# EAGLE design dremel (EAGLE 6.5.0)
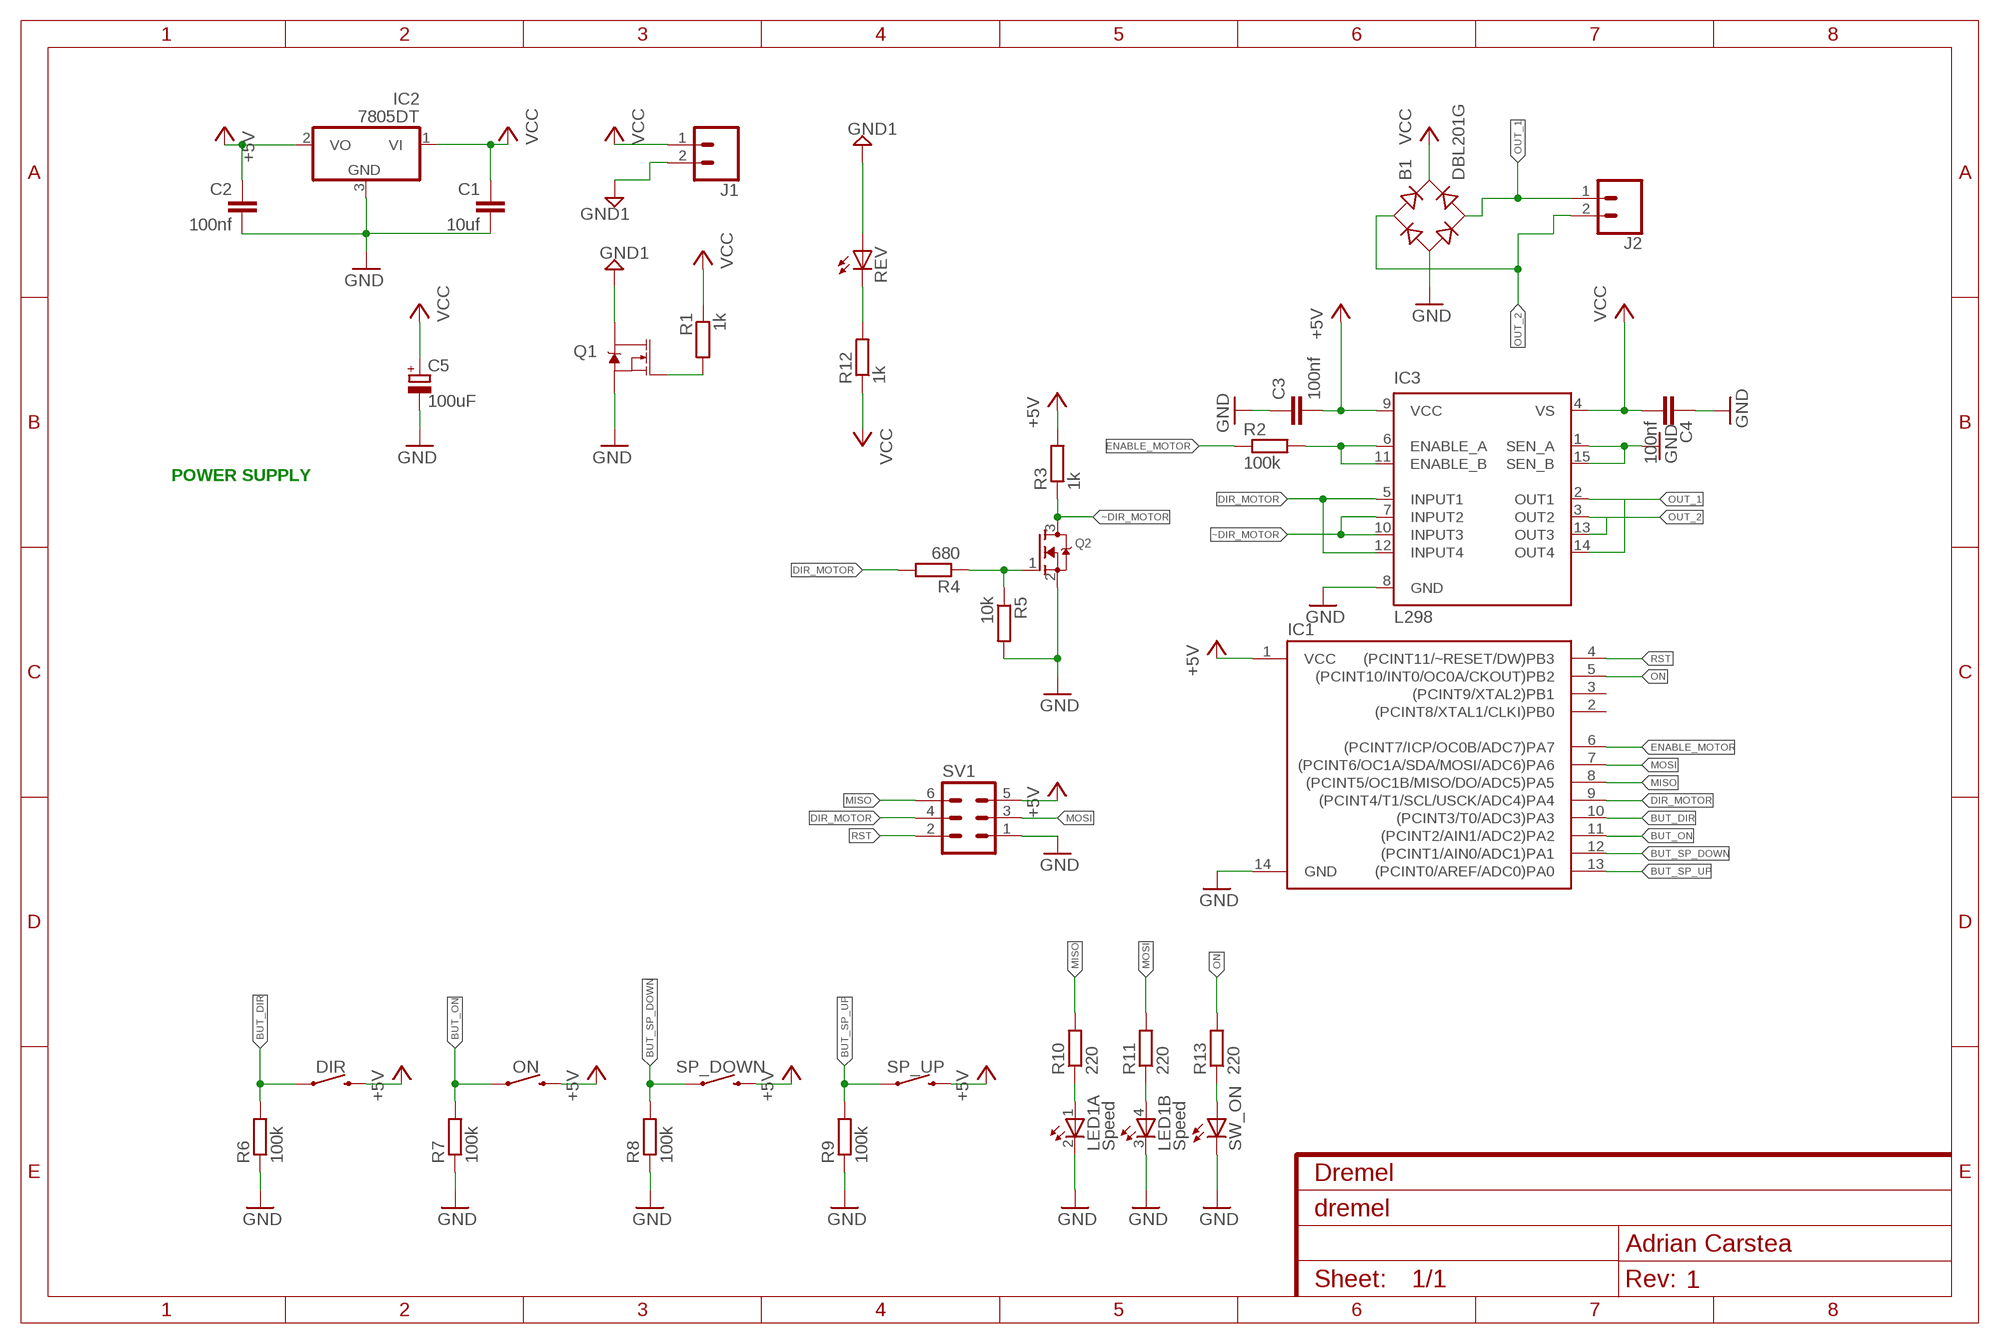
[diagram p0: schematic, sheet 1]
FRAME1 (FRAME-A4L): CNAME: Dremel; CREVISION: 1; DESIGNER: Adrian Carstea

## Parts
B1  DBL201G  [DB]
C1  10uf  C-EUC1206  [C1206]
C2  100nf  C-EUC1206  [C1206]
C3  100nf  C-EUC1206  [C1206]
C4  100nf  C-EUC1206  [C1206]
C5  100uF  CPOL-EUE5-10.5  [E5-10,5]
DIR  MOMENTARY-SWITCH-SPST-SMD-5.2MM  [TACTILE_SWITCH_SMD_5.2MM]
IC1  ATTINY84ATTINY84-20PU  [DIP14]
IC2  7805DT  [TO252]
IC3  L298  [MULTIWATT-15]
J1  CONN_025MM  [SCREWTERMINAL-5MM-2]
J2  CONN_025MM  [SCREWTERMINAL-5MM-2]
LED1  Speed  TOPLED-2-/  [P-LCC-4/2]
ON  MOMENTARY-SWITCH-SPST-SMD-5.2MM  [TACTILE_SWITCH_SMD_5.2MM]
Q1  MOSFET-NCH-FDD8780  [DPAK]
Q2  MOSFET-NREFLOW  [SOT23]
R1  1k  R-EU_R0805  [R0805]
R2  100k  R-EU_M0805  [M0805]
R3  1k  R-EU_M0805  [M0805]
R4  680  R-EU_M0805  [M0805]
R5  10k  R-EU_M0805  [M0805]
R6  100k  R-EU_M0805  [M0805]
R7  100k  R-EU_M0805  [M0805]
R8  100k  R-EU_M0805  [M0805]
R9  100k  R-EU_M0805  [M0805]
R10  220  R-EU_M0805  [M0805]
R11  220  R-EU_M0805  [M0805]
R12  1k  R-EU_M0805  [M0805]
R13  220  R-EU_M0805  [M0805]
REV  LEDSML0805  [SML0805]
SP_DOWN  MOMENTARY-SWITCH-SPST-SMD-5.2MM  [TACTILE_SWITCH_SMD_5.2MM]
SP_UP  MOMENTARY-SWITCH-SPST-SMD-5.2MM  [TACTILE_SWITCH_SMD_5.2MM]
SV1  MA03-2  [MA03-2]
SW_ON  LEDSML0805  [SML0805]

## Nets
+5V: C2.1 C3.2 DIR.3 IC1.1(VCC) IC2.2(VO) IC3.9(VCC) ON.3 R3.2 SP_DOWN.3 SP_UP.3 SV1.5
BUT_DIR: DIR.1 IC1.10((PCINT3/T0/ADC3)PA3) R6.2
BUT_ON: IC1.11((PCINT2/AIN1/ADC2)PA2) ON.1 R7.2
BUT_SP_DOWN: IC1.12((PCINT1/AIN0/ADC1)PA1) R8.2 SP_DOWN.1
BUT_SP_UP: IC1.13((PCINT0/AREF/ADC0)PA0) R9.2 SP_UP.1
DIR_MOTOR: IC1.9((PCINT4/T1/SCL/USCK/ADC4)PA4) IC3.5(INPUT1) IC3.12(INPUT4) R4.2 SV1.4
ENABLE_MOTOR: IC1.6((PCINT7/ICP/OC0B/ADC7)PA7) R2.1
GND: B1.- C1.2 C2.2 C3.1 C4.1 C5.- IC1.14(GND) IC2.3(GND) IC3.1(SEN_A) IC3.8(GND) IC3.15(SEN_B) LED1.2(A:C) LED1.3(B:C) Q1.3(S) Q2.2(S) R5.2 R6.1 R7.1 R8.1 R9.1 SV1.1 SW_ON.C
GND1: J1.2 Q1.4(D) REV.A
MISO: IC1.8((PCINT5/OC1B/MISO/DO/ADC5)PA5) R10.2 SV1.6
MOSI: IC1.7((PCINT6/OC1A/SDA/MOSI/ADC6)PA6) R11.2 SV1.3
N$1: Q1.1(G) R1.2
N$2: IC3.6(ENABLE_A) IC3.11(ENABLE_B) R2.2
N$3: Q2.1(G) R4.1 R5.1
N$5: LED1.1(A:A) R10.1
N$6: LED1.4(B:A) R11.1
N$7: R12.2 REV.C
N$9: R13.1 SW_ON.A
ON: IC1.5((PCINT10/INT0/OC0A/CKOUT)PB2) R13.2
OUT_1: B1.AC2 IC3.2(OUT1) IC3.14(OUT4) J2.1
OUT_2: B1.AC1 IC3.3(OUT2) IC3.13(OUT3) J2.2
RST: IC1.4((PCINT11/~RESET/DW)PB3) SV1.2
VCC: B1.+ C1.1 C4.2 C5.+ IC2.1(VI) IC3.4(VS) J1.1 R1.1 R12.1
~DIR_MOTOR: IC3.7(INPUT2) IC3.10(INPUT3) Q2.3(D) R3.1
Unconnected: IC1.2((PCINT8/XTAL1/CLKI)PB0) IC1.3((PCINT9/XTAL2)PB1)

## Notes on the sheet
- POWER SUPPLY

## Library data of the parts
B1 = rectifier:DB?*G: Single Phase 1.0 AMP Glass Passivated Bridge Rectifier Taiwan Semiconductor Co.,Ltd. - TSC Source: http://www.taiwansemi.com/TSCbig5/ezcatfiles/cust/img/img/db101g.pdf http://www.ts.com.tw/db/pictures/modules/PDT/PDT060207001/DBLS201G.pdf
C1-C4 = rcl:C-EU: CAPACITOR, European symbol
C5 = rcl:CPOL-EU: POLARIZED CAPACITOR, European symbol
DIR ON SP_DOWN SP_UP = SparkFun-Switches:MOMENTARY-SWITCH-SPST: Momentary Switch (Pushbutton) - SPST Normally-open (NO) SPST momentary switches (buttons, pushbuttons). Variants PTH-12MM - 12mm square, through-hole Momentary Pushbutton Switch - 12mm Square <https://www.sparkfun.com/products/9190> (COM-09190) PTH-6.0MM, PTH-6.0MM-KIT - 6.0mm square, through-hole Mini Pushbutton Switch <https://www.sparkfun.com/products/97> (COM-00097) KIT package intended for soldering kit's - only one side of pads' copper is exposed. PTH-RIGHT-ANGLE-KIT - Right-angle, through-hole Right Angle Tactile Button <https://www.sparkfun.com/products/10791> - Used on SparkFun BigTime Watch Kit <https://www.sparkfun.com/products/11734> SMD-12MM - 12mm square, surface-mount Tactile Button - SMD (12mm) <https://www.sparkfun.com/products/12993> (COM-12993) Used on SparkFun PicoBoard <https://www.sparkfun.com/products/11888> SMD-4.5MM - 4.5mm Square Trackball Switch Used on SparkFun Blackberry Trackballer Breakout <https://www.sparkfun.com/products/13169> SMD-4.6MMX2.8MM - 4.60mm x 2.80mm, surface mount Used on SparkFun SAMD21 Mini Breakout <https://www.sparkfun.com/products/13664> SMD-5.2MM, SMD-5.2-REDUNDANT - 5.2mm square, surface-mount Mini Pushbutton Switch - SMD <https://www.sparkfun.com/products/8720> (COM-08720) Used on Arduino Pro Mini <https://www.sparkfun.com/products/11114> REDUNDANT package connects both switch circuits together SMD-6.0X3.5MM - 6.0 x 3.5mm, surface mount Momentary Reset Switch SMD <https://www.sparkfun.com/products/8229> (COM-08229) SMD-6.2MM-TALL - 6.2mm square, surface mount Tactile Button - SMD (6mm) <https://www.sparkfun.com/products/12992> Used on SparkFun Digital Sandbox <https://www.sparkfun.com/products/12651> SMD-RIGHT-ANGLE - Right-angle, surface mount Used on SparkFun Block for Intel® Edison - Arduino <https://www.sparkfun.com/products/13036>; PROD_ID: SWCH-08247; SF_SKU: COM-08720
IC1 = SparkFun-IC-Microcontroller:ATTINY84: Atmel 14-pin 2/4/8kB flash uC Datasheet <https://cdn.sparkfun.com/datasheets/Widgets/doc8006.pdf> SparkFun Products Tiny AVR Programmer <https://www.sparkfun.com/products/11801> (PGM-11801) SparkFun Servo Trigger - Continuous Rotation <https://www.sparkfun.com/products/13872> (WIG-13872) SparkFun Servo Trigger <https://www.sparkfun.com/products/13118> (WIG-13118)
IC2 = adafruit:78*: Positive VOLTAGE REGULATOR Added bigger pads to the TO-92 package
IC3 = st-microelectronics:L298: DUAL FULL-BRIDGE DRIVER; MPN: L298N; OC_FARNELL: 1589425; OC_NEWARK: 32M1527
J1 J2 = SparkFun-Connectors:CONN_02: Multi connection point. Often used as Generic Header-pin footprint for 0.1 inch spaced/style header connections On any of the 0.1 inch spaced packages, you can populate with these: Break Away Headers - Straight <https://www.sparkfun.com/products/116> (PRT-00116) Break Away Male Headers - Right Angle <https://www.sparkfun.com/products/553> (PRT-00553) Female Headers <https://www.sparkfun.com/products/115> (PRT-00115) Break Away Headers - Machine Pin <https://www.sparkfun.com/products/117> (PRT-00117) Break Away Female Headers - Swiss Machine Pin <https://www.sparkfun.com/products/743> (PRT-00743) For SCREWTERMINALS and SPRING TERMINALS visit here: Screw Terimnals on SparkFun.com <https://www.sparkfun.com/search/results?term=Screw+Terminals> (5mm/3.5mm/2.54mm spacing) This device is also useful as a general connection point to wire up your design to another part of your project. Our various solder wires solder well into these plated through hole pads. Hook-Up Wire - Assortment (Stranded, 22 AWG) <https://www.sparkfun.com/products/11375> (PRT-11375) Hook-Up Wire - Assortment (Solid Core, 22 AWG) <https://www.sparkfun.com/products/11367> (PRT-11367) View the entire wire category on our website here <https://www.sparkfun.com/categories/141> Special notes: Molex polarized connector foot print use with: PRT-08233 with associated crimp pins and housings. 2.54_SCREWTERM for use with PRT-10571. 3.5mm Screw Terminal footprints for PRT-08084 5mm Screw Terminal footprints for use with PRT-08432; SF_SKU: PRT-08432
LED1 = led:TOPLED-2-: Multi TOPLED® (two color) LG T672, LP T672 LSY T67B LSW T67C LSY T675 LSY T676 LSG T677 LSG T770 Source: http://www.osram.convergy.de/
Q1 = SparkFun-DiscreteSemi:MOSFET-NCH: N-channel MOSFETs Voltage controlled devices that allow control of high current outputs. SparkFun Products: SparkFun OpenScale <https://www.sparkfun.com/products/13261> SparkFun Digital Sandbox <https://www.sparkfun.com/products/12651> SparkFun Monster Moto Shield <https://www.sparkfun.com/products/10182> SparkFun MOSFET Power Controller <https://www.sparkfun.com/products/11214>; PROD_ID: TRANS-09984; VALUE: 35A/25V/8.5mΩ
Q2 = adafruit:MOSFET-N: N-Channel Mosfet 2N7002E - 60V 260mA SOT23 [Digikey: 2N7002ET1GOSTR-ND] - REEL BSH103 - 30V 850mA SOT23 [Digikey: 568-5013-1-ND]
R1-R13 = rcl:R-EU_: RESISTOR, European symbol
REV SW_ON = led:LED: LED OSRAM: - CHIPLED LG R971, LG N971, LY N971, LG Q971, LY Q971, LO R971, LY R971 LH N974, LH R974 LS Q976, LO Q976, LY Q976 LO Q996 - Hyper CHIPLED LW Q18S LB Q993, LB Q99A, LB R99A - SideLED LS A670, LO A670, LY A670, LG A670, LP A670 LB A673, LV A673, LT A673, LW A673 LH A674 LY A675 LS A676, LA A676, LO A676, LY A676, LW A676 LS A679, LY A679, LG A679 - Hyper Micro SIDELED® LS Y876, LA Y876, LO Y876, LY Y876 LT Y87S - SmartLED LW L88C, LW L88S LB L89C, LB L89S, LG L890 LS L89K, LO L89K, LY L89K LS L896, LA L896, LO L896, LY L896 - TOPLED LS T670, LO T670, LY T670, LG T670, LP T670 LSG T670, LSP T670, LSY T670, LOP T670, LYG T670 LG T671, LOG T671, LSG T671 LB T673, LV T673, LT T673, LW T673 LH T674 LS T676, LA T676, LO T676, LY T676, LB T676, LH T676, LSB T676, LW T676 LB T67C, LV T67C, LT T67C, LS T67K, LO T67K, LY T67K, LW E67C LS E67B, LA E67B, LO E67B, LY E67B, LB E67C, LV E67C, LT E67C LW T67C LS T679, LY T679, LG T679 LS T770, LO T770, LY T770, LG T770, LP T770 LB T773, LV T773, LT T773, LW T773 LH T774 LS E675, LA E675, LY E675, LS T675 LS T776, LA T776, LO T776, LY T776, LB T776 LHGB T686 LT T68C, LB T68C - Hyper Mini TOPLED® LB M676 - Mini TOPLED Santana® LG M470 LS M47K, LO M47K, LY M47K Source: http://www.osram.convergy.de LUXEON: - LUMILED® LXK2-PW12-R00, LXK2-PW12-S00, LXK2-PW14-U00, LXK2-PW14-V00 LXK2-PM12-R00, LXK2-PM12-S00, LXK2-PM14-U00 LXK2-PE12-Q00, LXK2-PE12-R00, LXK2-PE12-S00, LXK2-PE14-T00, LXK2-PE14-U00 LXK2-PB12-K00, LXK2-PB12-L00, LXK2-PB12-M00, LXK2-PB14-N00, LXK2-PB14-P00, LXK2-PB14-Q00 LXK2-PR12-L00, LXK2-PR12-M00, LXK2-PR14-Q00, LXK2-PR14-R00 LXK2-PD12-Q00, LXK2-PD12-R00, LXK2-PD12-S00 LXK2-PH12-R00, LXK2-PH12-S00 LXK2-PL12-P00, LXK2-PL12-Q00, LXK2-PL12-R00 Source: www.luxeon.com KINGBRIGHT: KA-3528ASYC Source: www.kingbright.com
SV1 = con-lstb:MA03-2: PIN HEADER; OC_FARNELL: unknown; OC_NEWARK: unknown

## Board
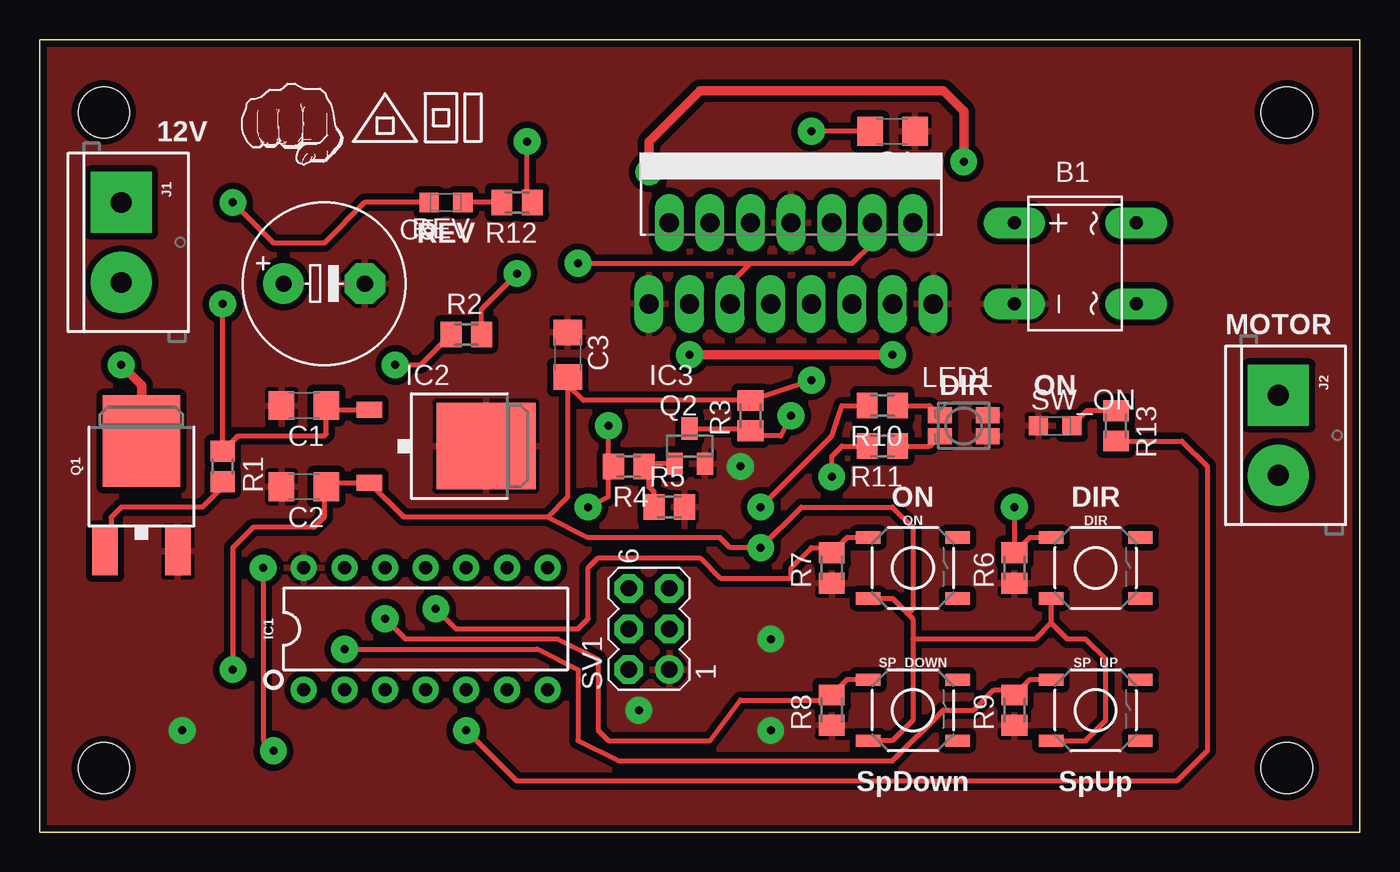
[diagram p1: board, top side]
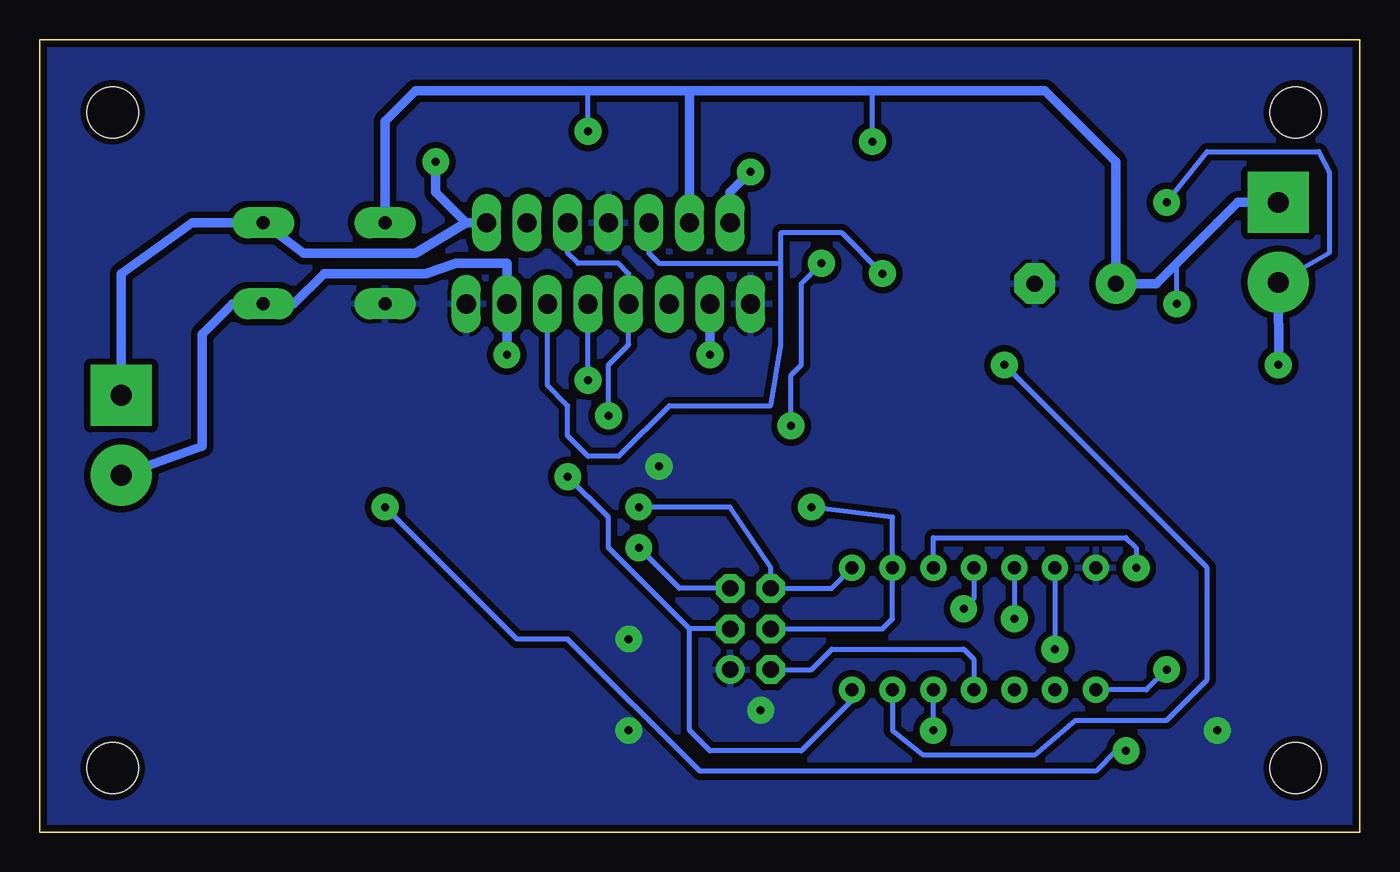
[diagram p2: board, bottom side, seen from below]

Size 82.55 x 49.53 mm. Coordinates in mm from the lower left corner, seen from the top.
Outline: 0,0 82.55,0 82.55,49.53 0,49.53 0,0
Copper layers (1*16): Top 0.0356mm / dielectric 1.5011mm / Bottom 0.0356mm
Design rules "oshpark-2layer *": minimum track width 6mil, minimum drill 13mil, track to track 6mil, track to pad 6mil, pad to pad 6mil, via to via 6mil, smd to smd 6mil, copper to edge 15mil, drill to drill 6mil, minimum pad ring 7mil, minimum via ring 7mil, stop-mask expansion 2.5mil, vias tented up to drill 20mil, thermal gap 10mil
Holes 3.2 mm at 4,4 4,45 78,45 78,4

### Footprints (pad centres in the part's own frame; a part is rotated, then mirrored left to right if it is on the bottom)
DB = drill 0.813 pad 1.93 long: + -2.54,-3.81; - 2.54,-3.81; AC1 2.54,3.81; AC2 -2.54,3.81
C1206 = smd 1.6 x 1.8: 1 -1.4,0; 2 1.4,0
E5-10,5 = drill 1.016 pad 2.54: + -2.54,0 | drill 1.016 pad 2.54 octagon: - 2.54,0
TACTILE_SWITCH_SMD_5.2MM = smd 1.524 x 0.762: 1 -2.794,1.905; 2 2.794,1.905; 3 -2.794,-1.905; 4 2.794,-1.905
DIP14 = drill 0.813 pad 1.626: 1 -7.62,-3.81; 2 -5.08,-3.81; 3 -2.54,-3.81; 4 0,-3.81; 5 2.54,-3.81; 6 5.08,-3.81; 7 7.62,-3.81; 8 7.62,3.81; 9 5.08,3.81; 10 2.54,3.81; 11 0,3.81; 12 -2.54,3.81; 13 -5.08,3.81; 14 -7.62,3.81
TO252 = smd 1 x 1.6: 1 -2.28,-4.8; 2 2.28,-4.8 | smd 5.4 x 6.2: 3 0,2.5
MULTIWATT-15 = drill 1.2 long: 1 -8.89,-7.62; 2 -7.62,-2.54; 3 -6.35,-7.62; 4 -5.08,-2.54; 5 -3.81,-7.62; 6 -2.54,-2.54; 7 -1.27,-7.62; 8 0,-2.54; 9 1.27,-7.62; 10 2.54,-2.54; 11 3.81,-7.62; 12 5.08,-2.54; 13 6.35,-7.62; 14 7.62,-2.54; 15 8.89,-7.62
SCREWTERMINAL-5MM-2 = drill 1.3 pad 3.81 square: 1 0,0 | drill 1.3 pad 3.81: 2 5,0
P-LCC-4/2 = smd 1 x 1.5: 1 -0.65,-1.5; 2 -0.65,1.5; 3 0.65,1.5; 4 0.65,-1.5
DPAK = smd 1.6 x 3: 1 -2.28,-5.31; 3 2.28,-5.31 | smd 4.826 x 5.715: 4 0,1.588
SOT23 = smd 1 x 1.4: 1 -0.95,-1.1; 2 0.95,-1.1; 3 0,1.1
R0805 = smd 1.3 x 1.5: 1 -0.95,0; 2 0.95,0
M0805 = smd 1.3 x 1.6: 1 -0.95,0; 2 0.95,0
SML0805 = smd 1.2 x 1.2: A 1.05,0; C -1.05,0
MA03-2 = drill 1.016 pad 1.778: 1 -2.54,-1.27 | drill 1.016 pad 1.778 octagon: 2 -2.54,1.27; 3 0,-1.27; 4 0,1.27; 5 2.54,-1.27; 6 2.54,1.27

### Placement (x,y rotation side)
B1  64.77,35.56 270 top
C1  16.51,26.67 180 top
C2  16.51,21.59 180 top
C3  33.02,29.84 270 top
C4  53.34,43.81 180 top
C5  17.78,34.29 0 top
DIR  66.04,16.51 0 top
IC1  24.13,12.7 0 top
IC2  25.4,24.13 270 top
IC3  46.99,40.64 0 top
J1  5.08,39.37 270 top
J2  77.47,27.3 270 top
LED1  57.78,25.4 270 top
ON  54.61,16.51 0 top
Q1  6.35,22.86 0 top
Q2  40.64,24.13 0 top
R1  11.43,22.86 270 top
R2  26.67,31.11 0 top
R3  44.45,26.04 90 top
R4  36.83,22.86 180 top
R5  39.37,20.32 0 top
R6  60.96,16.51 90 top
R7  49.53,16.51 90 top
R8  49.53,7.62 90 top
R9  60.96,7.62 90 top
R10  52.7,26.67 180 top
R11  52.7,24.13 180 top
R12  29.84,39.37 180 top
R13  67.31,25.4 270 top
REV  25.4,39.37 180 top
SP_DOWN  54.61,7.62 0 top
SP_UP  66.04,7.62 0 top
SV1  38.1,12.7 90 top
SW_ON  63.5,25.4 0 top
U$1  [ADILOGO]  20.32,43.18 0 top

### Tracks (layer width: path | path; a pad name or v marks a point on that pad's centre or on a via)
+5V  (via drill 0.5 pad 1.68)
  Top 0.305: v12.06,10.16 12.06,17.78 13.34,19.05 17.14,19.05 17.78,19.68 17.78,21.46 C2.1 18.17,21.85 IC2.2 22.77,19.68 31.75,19.68 | 31.75,19.68 33.02,20.95 33.02,27.94 | 31.75,19.68 34.29,18.41 42.55,18.41 43.18,17.78 v45.09,17.78 47.62,20.32 53.34,20.32 54.61,19.05 54.61,13.97 54.29,13.65 | ON.3 53.34,14.61 54.29,13.65 | 54.29,13.65 54.61,13.34 54.61,12.06 | 54.61,12.06 54.61,6.99 53.34,5.71 SP_DOWN.3 | DIR.3 63.25,13.08 | 63.25,13.08 62.23,12.06 54.61,12.06 | SP_UP.3 65.41,5.71 66.67,6.99 66.67,10.79 65.41,12.06 64.26,12.06 63.25,13.08 | C3.2 33.02,27.94 | v48.26,28.26 R3.2 33.98,26.98 33.02,27.94
  Bottom 0.305: v12.06,10.16 13.34,8.89 IC1.1 | SV1.5 42.55,15.24 v45.09,17.78 | v48.26,28.26 IC3.9
BUT_DIR  (via drill 0.5 pad 1.68)
  Top 0.305: DIR.1 61.91,18.41 R6.2 v60.96,20.32 | v13.97,16.51 13.97,5.71 v14.61,5.08
  Bottom 0.305: IC1.10 26.67,18.41 14.61,18.41 13.97,17.78 v13.97,16.51 | v14.61,5.08 15.24,5.08 16.51,3.81 41.27,3.81 49.53,12.06 52.7,12.06 v60.96,20.32
BUT_ON  (via drill 0.5 pad 1.68)
  Top 0.305: ON.1 50.48,18.41 R7.2 49.21,17.78 48.26,17.78 46.99,16.51 46.99,15.88 42.55,15.88 41.27,17.14 34.92,17.14 34.29,16.51 34.29,13.34 33.66,12.7 26.04,12.7 v24.77,13.97
  Bottom 0.305: IC1.11 24.13,14.61 v24.77,13.97
BUT_SP_DOWN  (via drill 0.5 pad 1.68)
  Top 0.305: SP_DOWN.1 50.48,9.53 R8.2 49.22,8.26 43.81,8.26 41.91,5.71 35.56,5.71 34.92,6.35 34.92,10.79 32.38,12.06 22.86,12.06 v21.59,13.34
  Bottom 0.305: IC1.12 v21.59,13.34
BUT_SP_UP  (via drill 0.5 pad 1.68)
  Top 0.305: SP_UP.1 61.91,9.53 R9.2 60.64,8.89 59.69,8.89 58.42,7.62 56.52,7.62 53.34,4.45 36.2,4.45 33.66,5.71 33.66,10.16 31.11,11.43 v19.05,11.43
  Bottom 0.305: IC1.13 v19.05,11.43
DIR_MOTOR  (via drill 0.5 pad 1.68)
  Top 0.305: v34.29,20.32 35.56,20.95 35.56,22.54 R4.2 35.56,22.86 v35.56,25.4 | IC3.5 43.18,34.29 44.45,35.56 | 44.45,35.56 50.8,35.56 52.07,36.83 IC3.12 | v33.66,35.56 44.45,35.56
  Bottom 0.305: v34.29,20.32 29.21,19.68 IC1.9 29.21,13.34 29.84,12.7 SV1.4 | v35.56,25.4 35.56,28.57 34.92,29.21 34.92,34.29 v33.66,35.56
ENABLE_MOTOR  (via drill 0.5 pad 1.68)
  Top 0.305: v22.23,29.21 23.82,29.21 R2.1
  Bottom 0.305: IC1.6 29.21,6.35 27.3,4.83 20.32,4.83 17.78,6.99 12.06,6.99 9.53,9.53 9.53,16.51 v22.23,29.21
GND  (via drill 0.5 pad 1.68)
  other vias: 8.89,6.35 37.47,7.62 45.72,6.35 45.72,12.06 43.81,22.86
  pour Top (isolate 0.4): 82.55,0 0,0 0,49.53 82.55,49.53
  pour Bottom (isolate 0.4): 82.55,0 0,0 0,49.53 82.55,49.53
GND1  (via drill 0.5 pad 1.68)
  Top 0.305: REV.A 20.32,39.37 17.78,36.83 14.61,36.83 v12.06,39.37
  Top 0.61: Q1.4 6.35,27.94 v5.08,29.21
  Bottom 0.305: v12.06,39.37 9.53,42.55 2.54,42.55 1.91,41.27 1.91,36.2 J1.2
  Bottom 0.61: v5.08,29.21 5.07,29.22 J1.2
MISO  (via drill 0.5 pad 1.68)
  Top 0.305: v45.09,20.32 49.53,24.77 50.16,26.67 R10.2
  Bottom 0.305: IC1.8 33.02,15.24 SV1.6 36.83,16.51 39.37,20.32 v45.09,20.32
MOSI  (via drill 0.5 pad 1.68)
  Top 0.305: v49.53,22.23 49.53,23.5 50.16,24.13 R11.2
  Bottom 0.305: SV1.3 41.91,12.7 | 41.91,12.7 46.99,17.78 46.99,19.68 v49.53,22.23 | IC1.7 31.75,8.26 34.92,5.08 40.64,5.08 41.91,6.35 41.91,12.7
N$1
  Top 0.305: R1.2 11.43,21.59 10.16,20.32 5.08,20.32 4.45,19.68 4.45,17.93 Q1.1
N$2  (via drill 0.5 pad 1.68)
  Top 0.305: R2.2 27.62,32.7 v29.84,34.92
  Bottom 0.305: 36.2,35.56 36.2,30.48 36.83,26.67 43.18,26.67 46.35,23.5 48.26,23.5 49.53,24.77 49.53,26.67 50.8,27.94 IC3.11 | 36.2,35.56 36.2,37.47 32.38,37.47 v29.84,34.92 | IC3.6 44.45,36.2 43.81,35.56 36.2,35.56
N$3
  Top 0.305: R5.1 38.42,21.27 38.1,21.59 38.1,22.54 R4.1 37.95,23.03 Q2.1
N$5
  Top 0.305: R10.1 55.66,26.67 LED1.1
N$6
  Top 0.305: R11.1 55.66,24.13 LED1.4
N$7
  Top 0.305: R12.2 REV.C
N$9
  Top 0.305: R13.1 65.5,26.35 SW_ON.A
ON  (via drill 0.5 pad 1.68)
  Top 0.305: R13.2 71.44,24.45 73.03,22.86 73.03,5.08 71.12,3.17 29.84,3.17 v26.67,6.35
  Bottom 0.305: v26.67,6.35 IC1.5
OUT_1  (via drill 0.5 pad 1.68)
  Top 0.61: v38.1,41.27 38.1,43.18 41.27,46.35 56.52,46.35 57.78,45.09 v57.78,41.91
  Bottom 0.61: 55.88,38.1 59.05,36.2 66.04,36.2 B1.AC2 73.03,38.1 77.47,34.92 J2.1 | v38.1,41.27 39.37,40.01 IC3.2 | 55.88,38.1 IC3.14 | v57.78,41.91 57.78,40.01 55.88,38.1
OUT_2  (via drill 0.5 pad 1.68)
  Top 0.61: v40.64,29.84 v53.34,29.84
  Bottom 0.61: v53.34,29.84 IC3.13 53.34,35.56 56.52,35.56 58.42,34.92 64.77,34.92 66.67,33.02 B1.AC1 70.48,33.02 72.39,31.11 72.39,24.13 J2.2 | IC3.3 v40.64,29.84
RST
  Bottom 0.305: SV1.2 34.29,10.16 33.02,11.43 24.77,11.43 24.13,10.79 IC1.4
VCC  (via drill 0.5 pad 1.68)
  Top 0.305: v11.43,33.02 R1.1 12.38,24.77 17.78,24.77 17.91,24.89 C1.1 18.17,26.41 IC2.1 | C4.2 v48.26,43.81 | R12.1 30.48,39.37 v30.48,43.18
  Bottom 0.305: v11.43,33.02 11.43,35.56 8.89,38.1 | v48.26,43.81 48.26,46.35 | v30.48,43.18 30.48,46.35
  Bottom 0.61: 41.91,46.35 30.48,46.35 19.68,46.35 15.24,41.91 C5.+ 12.7,34.29 8.89,38.1 7.62,39.37 J1.1 | 41.91,46.35 48.26,46.35 59.05,46.35 60.96,44.45 B1.+ | IC3.4 41.91,46.35
~DIR_MOTOR  (via drill 0.5 pad 1.68)
  Top 0.305: Q2.3 44.3,25.23 R3.1 44.77,24.77 46.35,24.77 v46.99,26.04
  Bottom 0.305: v46.99,26.04 46.99,29.21 45.72,30.48 IC3.7 45.72,34.92 46.35,35.56 48.9,35.56 49.53,36.2 IC3.10

### Text on the board
tPlace: 12V | REV | MOTOR | DIR | ON | ON | DIR | SpDown | SpUp